# Altium schematic sheet Main_Diagram.SchDoc
size A; SheetNumber: 1; SheetTotal: 3
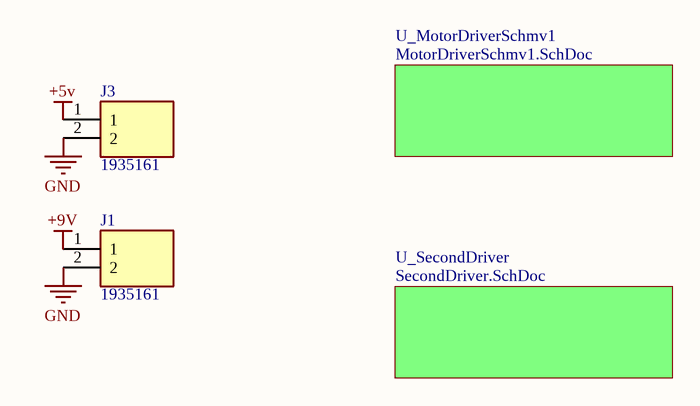
[diagram p0: Main_Diagram.SchDoc]

## Parts
J1  1935161  [1935161]
J3  1935161  [1935161]

## Sub-sheets
U_MotorDriverSchmv1 = MotorDriverSchmv1.SchDoc: no entries
U_SecondDriver = SecondDriver.SchDoc: no entries

## Nets
+5v: J3.1
+9V: J1.1
GND: J1.2 J3.2

## Library data of the parts
J1 J3 = 1935161: Connector; Manufacturer_Name: Phoenix Contact; Datasheet Link: https://datasheet.datasheetarchive.com/originals/distributors/SFDatasheet-2/sf-00057459.pdf; Height: 11.55mm; Manufacturer_Part_Number: 1935161; Mouser Part Number: 651-1935161; Mouser Price/Stock: https://www.mouser.co.uk/ProductDetail/Phoenix-Contact/1935161?qs=W3wJikR1%252BS6eKzfFl8Rbew%3D%3D; Arrow Part Number: 1935161; Arrow Price/Stock: https://www.arrow.com/en/products/1935161/phoenix-contact?region=nac